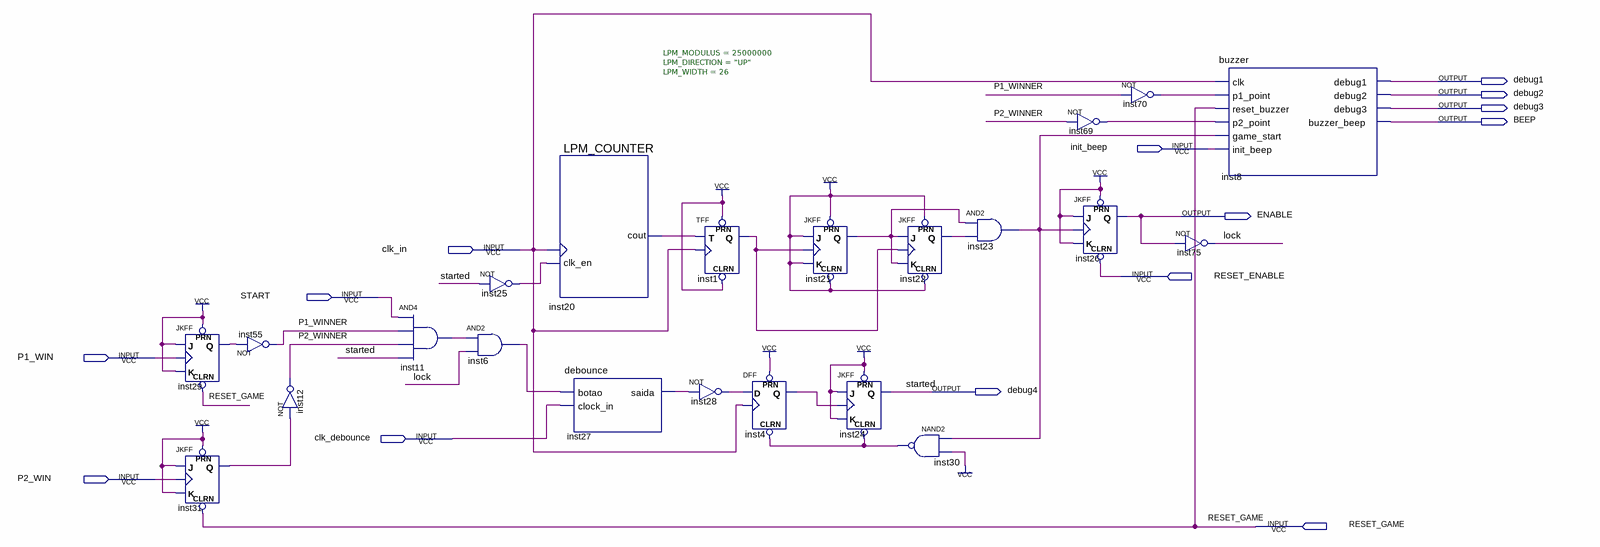
[diagram p0: schematic sheet]
// Quartus schematic game_control_beta.bdf as structural Verilog: 22 symbols, 14 pins
module game_control_beta (
  input  init_beep,
  input  clk_in,
  input  RESET_ENABLE,
  input  START,
  input  P1_WIN,
  input  clk_debounce,
  input  P2_WIN,
  input  RESET_GAME,
  output debug1,
  output debug2,
  output debug3,
  output BEEP,
  output ENABLE,
  output debug4
);

  wire inst1_q, inst4_q, inst6_out, inst11_out, inst20_cout, inst21_q, inst22_q, inst23_out, inst25_out,
       inst27_saida, inst28_out, inst29_q, inst30_out, inst31_q, inst69_out, inst70_out, lock, P1_WINNER,
       P2_WINNER;

  JKFF inst29 (.PRN(1'b1), .CLRN(RESET_GAME), .K(1'b1), .J(1'b1), .CLK(P1_WIN), .Q(inst29_q));
  JKFF inst31 (.PRN(1'b1), .CLRN(RESET_GAME), .K(1'b1), .J(1'b1), .CLK(P2_WIN), .Q(inst31_q));
  not inst55 (P1_WINNER, inst29_q);
  not inst12 (P2_WINNER, inst31_q);
  and inst11 (inst11_out, START, P1_WINNER, P2_WINNER, debug4);
  not inst25 (inst25_out, debug4);
  and inst6 (inst6_out, inst11_out, lock);
  LPM_COUNTER #(.LPM_MODULUS(25000000), .LPM_DIRECTION("UP"), .LPM_WIDTH(26)) inst20 (
    .clk_en(inst25_out), .clock(clk_in), .cout(inst20_cout));
  debounce inst27 (.botao(inst6_out), .clock_in(clk_debounce), .saida(inst27_saida));
  TFF inst1 (.PRN(1'b1), .CLRN(1'b1), .T(inst20_cout), .CLK(clk_in), .Q(inst1_q));
  not inst28 (inst28_out, inst27_saida);
  DFF inst4 (.CLRN(inst30_out), .CLK(clk_in), .D(inst28_out), .PRN(1'b1), .Q(inst4_q));
  JKFF inst21 (.PRN(1'b1), .CLRN(1'b1), .K(1'b1), .J(1'b1), .CLK(inst1_q), .Q(inst21_q));
  JKFF inst24 (.PRN(1'b1), .CLRN(inst30_out), .K(1'b1), .J(1'b1), .CLK(inst4_q), .Q(debug4));
  JKFF inst22 (.PRN(1'b1), .CLRN(1'b1), .K(inst21_q), .J(inst21_q), .CLK(inst1_q), .Q(inst22_q));
  nand inst30 (inst30_out, inst23_out, 1'b1);
  and inst23 (inst23_out, inst21_q, inst22_q);
  not inst69 (inst69_out, P2_WINNER);
  JKFF inst26 (.PRN(1'b1), .CLRN(RESET_ENABLE), .K(1'b1), .J(1'b1), .CLK(inst23_out), .Q(ENABLE));
  not inst70 (inst70_out, P1_WINNER);
  not inst75 (lock, ENABLE);
  buzzer inst8 (
    .clk(clk_in), .p1_point(inst70_out), .reset_buzzer(RESET_GAME), .p2_point(inst69_out),
    .game_start(inst23_out), .init_beep(init_beep), .debug1(debug1), .debug2(debug2), .debug3(debug3),
    .buzzer_beep(BEEP));

  // Other names for the same wires on the sheet: started = debug4
endmodule
